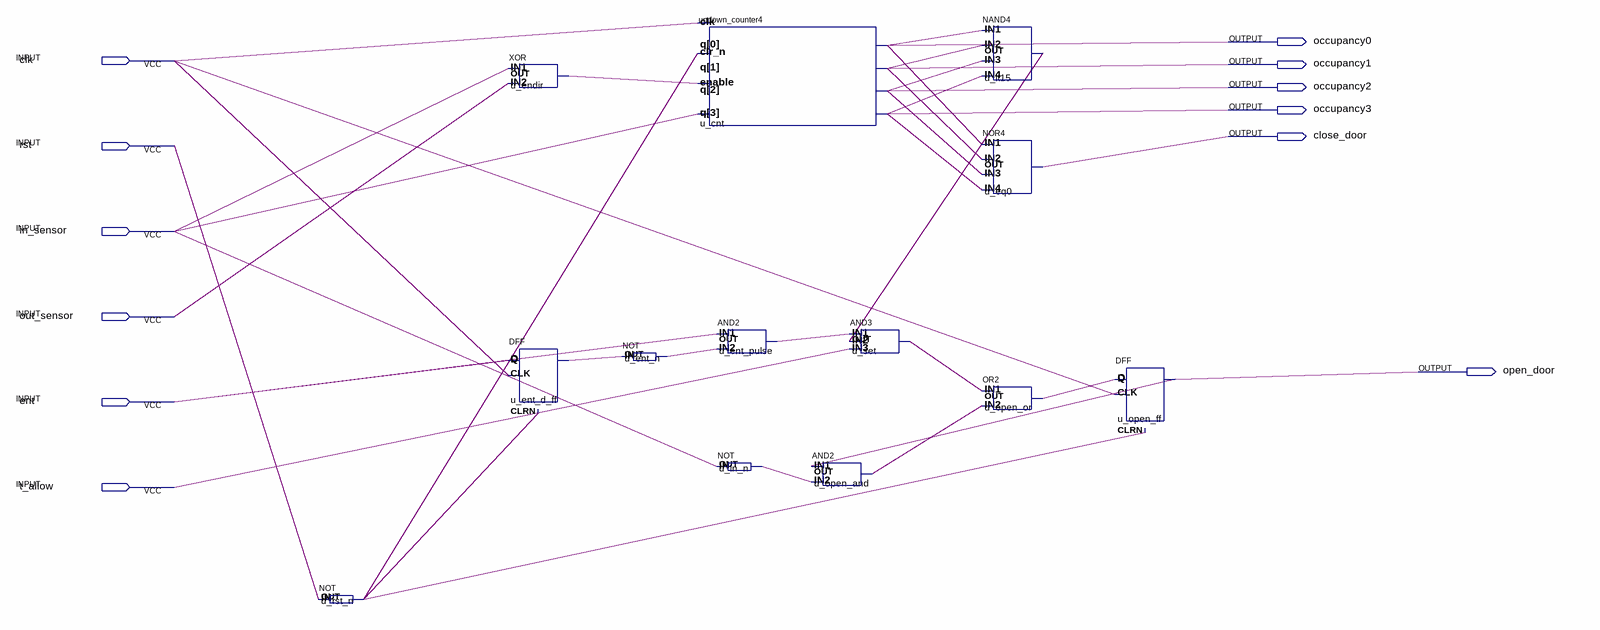
[diagram p0: schematic sheet]
// Quartus schematic waiting_room.bdf as structural Verilog: 13 symbols, 12 pins
module waiting_room (
  input  clk,
  input  rst,
  input  in_sensor,
  input  out_sensor,
  input  ent,
  input  t_allow,
  output occupancy0,
  output occupancy1,
  output occupancy2,
  output occupancy3,
  output close_door,
  output open_door
);

  wire u_endir_out, u_ent_d_ff_q, u_ent_n_out, u_ent_pulse_out, u_in_n_out, u_lt15_out, u_open_and_out,
       u_open_or_out, u_rst_n_out, u_set_out;

  not u_rst_n (u_rst_n_out, rst);
  xor u_endir (u_endir_out, in_sensor, out_sensor);
  DFF u_ent_d_ff (.CLRN(u_rst_n_out), .D(ent), .CLK(clk), .Q(u_ent_d_ff_q));
  not u_ent_n (u_ent_n_out, u_ent_d_ff_q);
  updown_counter4 u_cnt (
    .clk(clk), .clr_n(u_rst_n_out), .enable(u_endir_out), .u(in_sensor),
    .q({occupancy3, occupancy2, occupancy1, occupancy0}));
  and u_ent_pulse (u_ent_pulse_out, ent, u_ent_n_out);
  not u_in_n (u_in_n_out, in_sensor);
  and u_set (u_set_out, u_ent_pulse_out, u_lt15_out, t_allow);
  and u_open_and (u_open_and_out, open_door, u_in_n_out);
  nand u_lt15 (u_lt15_out, occupancy0, occupancy1, occupancy2, occupancy3);
  nor u_eq0 (close_door, occupancy0, occupancy1, occupancy2, occupancy3);
  or u_open_or (u_open_or_out, u_set_out, u_open_and_out);
  DFF u_open_ff (.CLRN(u_rst_n_out), .D(u_open_or_out), .CLK(clk), .Q(open_door));
endmodule
